# Altium schematic sheet SlideSwitchMCU.SchDoc
size A
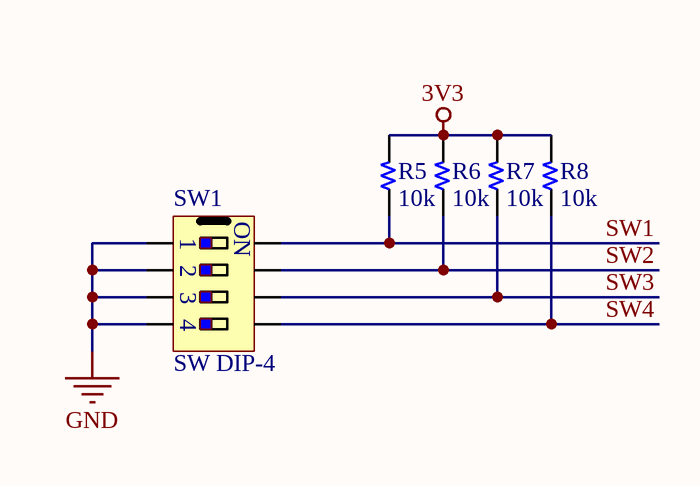
[diagram p0: SlideSwitchMCU.SchDoc]

## Parts
R5  10k  [R 0805]
R6  10k  [R 0805]
R7  10k  [R 0805]
R8  10k  [R 0805]
SW1  SW DIP-4  [SW/DIP4]

## Nets
3V3: R5.2 R6.2 R7.2 R8.2
GND: SW1.1 SW1.2 SW1.3 SW1.4
SW1: R5.1 SW1.8
SW2: R6.1 SW1.7
SW3: R7.1 SW1.6
SW4: R8.1 SW1.5

## Notes on the sheet
- (in symbol SW DIP-4) ON

## Library data of the parts
R5-R8 = Resistor